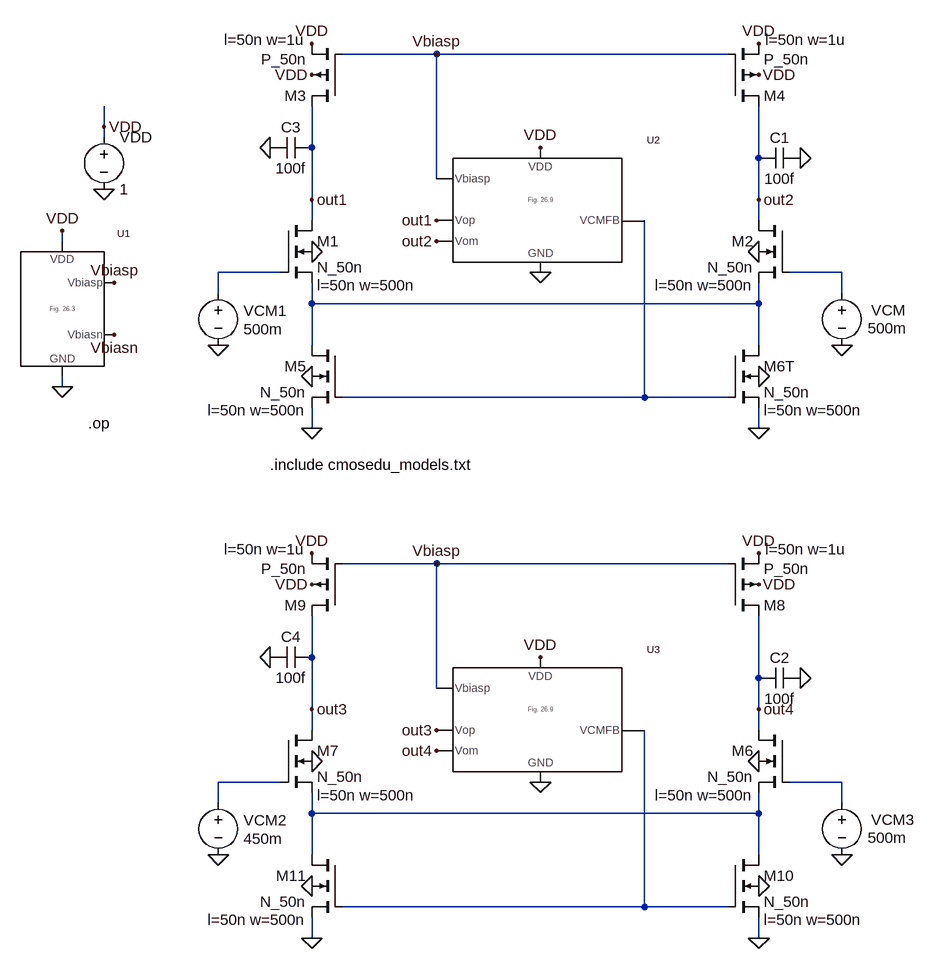
[diagram p0: schematic Fig26_10.asc]
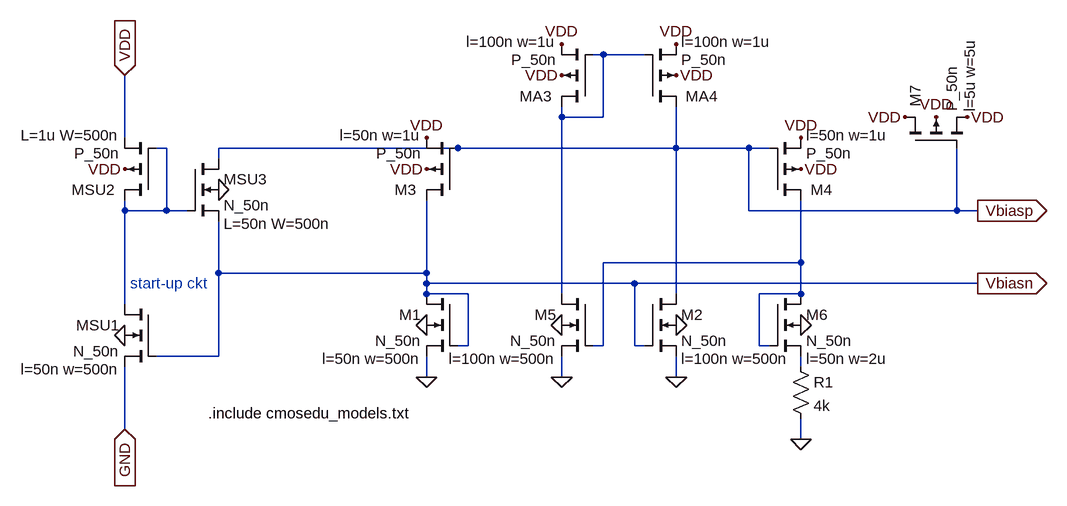
[diagram p1: sub-circuit fig_26_3.asc]
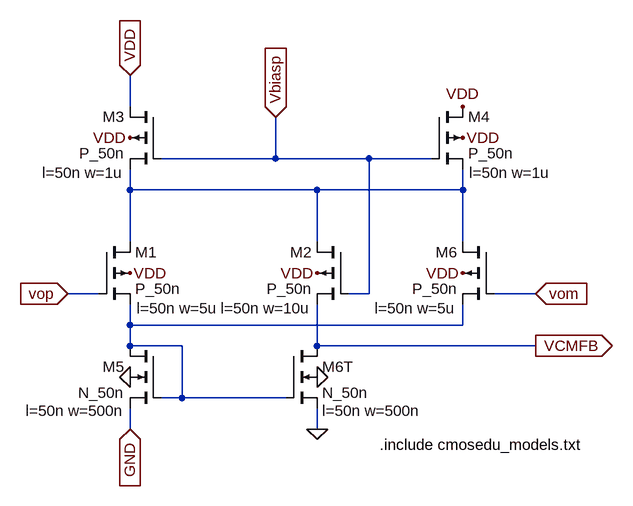
[diagram p2: sub-circuit fig_26_9.asc]
Fig26_10.asc, the LTspice schematic file:
Version 4
SHEET 1 3276 916
WIRE 1376 -464 1232 -464
WIRE 1824 -464 1376 -464
WIRE 864 -352 864 -384
WIRE 864 -336 864 -352
WIRE 1184 -320 1184 -384
WIRE 1872 -304 1872 -384
WIRE 1376 -272 1376 -464
WIRE 1184 -240 1184 -320
WIRE 1872 -240 1872 -304
WIRE 1184 -208 1184 -240
WIRE 1872 -208 1872 -240
WIRE 800 -176 800 -192
WIRE 1136 -128 1040 -128
WIRE 2000 -128 1920 -128
WIRE 1040 -96 1040 -128
WIRE 2000 -96 2000 -128
WIRE 1184 -80 1184 -112
WIRE 1872 -80 1872 -112
WIRE 1872 -80 1184 -80
WIRE 1184 -16 1184 -80
WIRE 1872 -16 1872 -80
WIRE 800 48 800 32
WIRE 1696 64 1696 -208
WIRE 1696 64 1232 64
WIRE 1824 64 1696 64
WIRE 1184 112 1184 80
WIRE 1872 112 1872 80
WIRE 1376 320 1232 320
WIRE 1824 320 1376 320
WIRE 1184 464 1184 400
WIRE 1872 496 1872 400
WIRE 1376 512 1376 320
WIRE 1184 544 1184 464
WIRE 1872 544 1872 496
WIRE 1184 576 1184 544
WIRE 1872 576 1872 544
WIRE 1136 656 1040 656
WIRE 2000 656 1920 656
WIRE 1040 688 1040 656
WIRE 2000 688 2000 656
WIRE 1184 704 1184 672
WIRE 1872 704 1872 672
WIRE 1872 704 1184 704
WIRE 1184 768 1184 704
WIRE 1872 768 1872 704
WIRE 1696 848 1696 576
WIRE 1696 848 1232 848
WIRE 1824 848 1696 848
WIRE 1184 896 1184 864
WIRE 1872 896 1872 864
FLAG 864 -256 0
FLAG 864 -352 VDD
FLAG 1872 -160 0
FLAG 1872 112 0
FLAG 1184 -160 0
FLAG 1872 -480 VDD
FLAG 1872 -432 VDD
FLAG 1184 -432 VDD
FLAG 800 -192 VDD
FLAG 800 48 0
FLAG 1040 -16 0
FLAG 1184 -480 VDD
FLAG 1872 32 0
FLAG 2000 -16 0
FLAG 880 -32 Vbiasn
FLAG 880 -112 Vbiasp
FLAG 1184 112 0
FLAG 1184 32 0
FLAG 1376 -464 Vbiasp
FLAG 1184 -240 out1
FLAG 1872 -240 out2
FLAG 1536 -128 0
FLAG 1376 -208 out1
FLAG 1376 -176 out2
FLAG 1536 -320 VDD
FLAG 1872 624 0
FLAG 1872 896 0
FLAG 1184 624 0
FLAG 1872 304 VDD
FLAG 1872 352 VDD
FLAG 1184 352 VDD
FLAG 1040 768 0
FLAG 1184 304 VDD
FLAG 1872 816 0
FLAG 2000 768 0
FLAG 1184 896 0
FLAG 1184 816 0
FLAG 1376 320 Vbiasp
FLAG 1184 544 out3
FLAG 1872 544 out4
FLAG 1536 656 0
FLAG 1376 576 out3
FLAG 1376 608 out4
FLAG 1536 464 VDD
FLAG 1936 -304 0
FLAG 1936 496 0
FLAG 1120 -320 0
FLAG 1120 464 0
SYMBOL voltage 864 -352 R0
WINDOW 123 0 0 Left 2
WINDOW 39 0 0 Left 2
SYMATTR InstName VDD
SYMATTR Value 1
SYMBOL nmos4 1920 -208 M0
WINDOW 123 56 100 Left 2
SYMATTR Value2 l=50n w=500n
SYMATTR InstName M2
SYMATTR Value N_50n
SYMBOL nmos4 1136 -208 R0
WINDOW 123 56 100 Left 2
SYMATTR Value2 l=50n w=500n
SYMATTR InstName M1
SYMATTR Value N_50n
SYMBOL pmos4 1824 -384 M180
WINDOW 123 58 102 Left 2
WINDOW 0 56 16 Left 2
SYMATTR Value2 l=50n w=1u
SYMATTR InstName M4
SYMATTR Value P_50n
SYMBOL pmos4 1232 -384 R180
WINDOW 123 58 102 Left 2
WINDOW 0 56 16 Left 2
SYMATTR Value2 l=50n w=1u
SYMATTR InstName M3
SYMATTR Value P_50n
SYMBOL voltage 1040 -112 R0
WINDOW 0 39 43 Left 2
WINDOW 123 38 75 Left 2
WINDOW 39 0 0 Left 2
WINDOW 3 39 71 Left 2
SYMATTR InstName VCM1
SYMATTR Value 500m
SYMBOL nmos4 1824 -16 R0
WINDOW 123 56 100 Left 2
SYMATTR Value2 l=50n w=500n
SYMATTR InstName M6T
SYMATTR Value N_50n
SYMBOL voltage 2000 -112 R0
WINDOW 0 45 42 Left 2
WINDOW 3 40 70 Left 2
WINDOW 123 0 0 Left 2
WINDOW 39 0 0 Left 2
SYMATTR InstName VCM
SYMATTR Value 500m
SYMBOL Fig_26_3 736 -64 R0
SYMATTR InstName U1
SYMBOL nmos4 1232 -16 M0
WINDOW 123 56 100 Left 2
SYMATTR Value2 l=50n w=500n
SYMATTR InstName M5
SYMATTR Value N_50n
SYMBOL Fig_26_9 1488 -208 R0
SYMATTR InstName U2
SYMBOL nmos4 1920 576 M0
WINDOW 123 56 100 Left 2
SYMATTR Value2 l=50n w=500n
SYMATTR InstName M6
SYMATTR Value N_50n
SYMBOL nmos4 1136 576 R0
WINDOW 123 56 100 Left 2
SYMATTR Value2 l=50n w=500n
SYMATTR InstName M7
SYMATTR Value N_50n
SYMBOL pmos4 1824 400 M180
WINDOW 123 58 102 Left 2
WINDOW 0 56 16 Left 2
SYMATTR Value2 l=50n w=1u
SYMATTR InstName M8
SYMATTR Value P_50n
SYMBOL pmos4 1232 400 R180
WINDOW 123 58 102 Left 2
WINDOW 0 56 16 Left 2
SYMATTR Value2 l=50n w=1u
SYMATTR InstName M9
SYMATTR Value P_50n
SYMBOL voltage 1040 672 R0
WINDOW 0 39 43 Left 2
WINDOW 123 38 75 Left 2
WINDOW 39 0 0 Left 2
WINDOW 3 39 71 Left 2
SYMATTR InstName VCM2
SYMATTR Value 450m
SYMBOL nmos4 1824 768 R0
WINDOW 123 56 100 Left 2
SYMATTR Value2 l=50n w=500n
SYMATTR InstName M10
SYMATTR Value N_50n
SYMBOL voltage 2000 672 R0
WINDOW 0 45 42 Left 2
WINDOW 3 40 70 Left 2
WINDOW 123 0 0 Left 2
WINDOW 39 0 0 Left 2
SYMATTR InstName VCM3
SYMATTR Value 500m
SYMBOL nmos4 1232 768 M0
WINDOW 123 56 100 Left 2
SYMATTR Value2 l=50n w=500n
SYMATTR InstName M11
SYMATTR Value N_50n
SYMBOL Fig_26_9 1488 576 R0
SYMATTR InstName U3
SYMBOL cap 1872 -320 M90
WINDOW 0 0 32 VBottom 2
WINDOW 3 32 32 VTop 2
SYMATTR InstName C1
SYMATTR Value 100f
SYMBOL cap 1872 480 M90
WINDOW 0 0 32 VBottom 2
WINDOW 3 32 32 VTop 2
SYMATTR InstName C2
SYMATTR Value 100f
SYMBOL cap 1184 -336 R90
WINDOW 0 0 32 VBottom 2
WINDOW 3 32 32 VTop 2
SYMATTR InstName C3
SYMATTR Value 100f
SYMBOL cap 1184 448 R90
WINDOW 0 0 32 VBottom 2
WINDOW 3 32 32 VTop 2
SYMATTR InstName C4
SYMATTR Value 100f
TEXT 1120 168 Left 2 !.include cmosedu_models.txt
TEXT 840 104 Left 2 !.op

fig_26_3.asc, the sub-circuit schematic file:
Version 4
SHEET 1 2004 680
WIRE 1280 -304 1264 -304
WIRE 1344 -304 1280 -304
WIRE 1216 -208 1216 -224
WIRE 1280 -208 1280 -304
WIRE 1280 -208 1216 -208
WIRE 544 -176 544 -272
WIRE 608 -160 592 -160
WIRE 1056 -160 688 -160
WIRE 1392 -160 1392 -224
WIRE 1392 -160 1056 -160
WIRE 1504 -160 1392 -160
WIRE 1536 -160 1504 -160
WIRE 688 -144 688 -160
WIRE 544 -64 544 -80
WIRE 608 -64 608 -160
WIRE 608 -64 544 -64
WIRE 640 -64 608 -64
WIRE 1504 -64 1504 -160
WIRE 1824 -64 1824 -160
WIRE 1824 -64 1504 -64
WIRE 1856 -64 1824 -64
WIRE 1584 16 1584 -80
WIRE 1584 16 1280 16
WIRE 688 32 688 -48
WIRE 1008 32 1008 -80
WIRE 1008 32 688 32
WIRE 1008 48 1008 32
WIRE 1328 48 1008 48
WIRE 1856 48 1328 48
WIRE 1008 64 1008 48
WIRE 1072 64 1008 64
WIRE 1216 64 1216 -208
WIRE 1392 64 1392 -160
WIRE 1584 64 1584 16
WIRE 1584 64 1520 64
WIRE 544 80 544 -64
WIRE 1072 144 1072 64
WIRE 1072 144 1056 144
WIRE 1280 144 1280 16
WIRE 1280 144 1264 144
WIRE 1328 144 1328 48
WIRE 1344 144 1328 144
WIRE 1520 144 1520 64
WIRE 1536 144 1520 144
WIRE 688 160 688 32
WIRE 688 160 592 160
WIRE 1584 176 1584 160
WIRE 1008 192 1008 160
WIRE 1216 192 1216 160
WIRE 1392 192 1392 160
WIRE 544 272 544 176
WIRE 1584 288 1584 256
FLAG 544 -128 VDD
FLAG 1008 -128 VDD
FLAG 1008 -176 VDD
FLAG 1584 -128 VDD
FLAG 1584 -176 VDD
FLAG 1584 288 0
FLAG 1584 112 0
FLAG 1392 -272 VDD
FLAG 1392 -320 VDD
FLAG 1216 -272 VDD
FLAG 1216 -320 VDD
FLAG 1392 112 0
FLAG 1792 -208 VDD
FLAG 1744 -208 VDD
FLAG 1840 -208 VDD
FLAG 544 -272 VDD
IOPIN 544 -272 In
FLAG 544 272 GND
IOPIN 544 272 In
FLAG 688 -96 0
FLAG 544 128 0
FLAG 1008 192 0
FLAG 1008 112 0
FLAG 1216 112 0
FLAG 1216 192 0
FLAG 1392 192 0
FLAG 1856 -64 Vbiasp
IOPIN 1856 -64 Out
FLAG 1856 48 Vbiasn
IOPIN 1856 48 Out
SYMBOL pmos4 592 -80 R180
WINDOW 0 63 16 Left 2
WINDOW 123 56 100 Left 2
SYMATTR InstName MSU2
SYMATTR Value2 L=1u W=500n
SYMATTR Value P_50n
SYMBOL nmos4 592 80 M0
WINDOW 123 56 100 Left 2
SYMATTR Value2 l=50n w=500n
SYMATTR InstName MSU1
SYMATTR Value N_50n
SYMBOL nmos4 640 -144 R0
WINDOW 123 56 100 Left 2
SYMATTR Value2 L=50n W=500n
SYMATTR InstName MSU3
SYMATTR Value N_50n
SYMBOL pmos4 1056 -80 R180
WINDOW 0 63 16 Left 2
WINDOW 123 56 100 Left 2
SYMATTR InstName M3
SYMATTR Value2 l=50n w=1u
SYMATTR Value P_50n
SYMBOL pmos4 1536 -80 M180
WINDOW 0 63 16 Left 2
WINDOW 123 56 100 Left 2
SYMATTR InstName M4
SYMATTR Value2 l=50n w=1u
SYMATTR Value P_50n
SYMBOL nmos4 1056 64 M0
WINDOW 123 56 100 Left 2
SYMATTR Value2 l=50n w=500n
SYMATTR InstName M1
SYMATTR Value N_50n
SYMBOL res 1568 160 R0
SYMATTR InstName R1
SYMATTR Value 4k
SYMBOL pmos4 1344 -224 M180
WINDOW 0 63 16 Left 2
WINDOW 123 56 100 Left 2
SYMATTR InstName MA4
SYMATTR Value2 l=100n w=1u
SYMATTR Value P_50n
SYMBOL pmos4 1264 -224 R180
WINDOW 0 63 16 Left 2
WINDOW 123 56 100 Left 2
SYMATTR InstName MA3
SYMATTR Value2 l=100n w=1u
SYMATTR Value P_50n
SYMBOL nmos4 1264 64 M0
WINDOW 123 56 100 Left 2
SYMATTR Value2 l=100n w=500n
SYMATTR InstName M5
SYMATTR Value N_50n
SYMBOL pmos4 1744 -160 R270
WINDOW 0 63 16 Left 2
WINDOW 123 56 100 Left 2
SYMATTR InstName M7
SYMATTR Value2 l=5u w=5u
SYMATTR Value P_50n
SYMBOL nmos4 1344 64 R0
WINDOW 123 56 100 Left 2
SYMATTR Value2 l=100n w=500n
SYMATTR InstName M2
SYMATTR Value N_50n
SYMBOL nmos4 1536 64 R0
WINDOW 123 56 100 Left 2
SYMATTR Value2 l=50n w=2u
SYMATTR InstName M6
SYMATTR Value N_50n
TEXT 552 48 Left 2 ;start-up ckt
TEXT 672 248 Left 2 !.include cmosedu_models.txt

fig_26_9.asc, the sub-circuit schematic file:
Version 4
SHEET 1 2684 680
WIRE 1184 -384 1184 -432
WIRE 1408 -304 1408 -368
WIRE 1408 -304 1232 -304
WIRE 1552 -304 1408 -304
WIRE 1648 -304 1552 -304
WIRE 1184 -256 1184 -288
WIRE 1472 -256 1184 -256
WIRE 1696 -256 1696 -288
WIRE 1696 -256 1472 -256
WIRE 1184 -176 1184 -256
WIRE 1472 -176 1472 -256
WIRE 1696 -176 1696 -256
WIRE 1136 -96 1088 -96
WIRE 1552 -96 1552 -304
WIRE 1552 -96 1520 -96
WIRE 1808 -96 1744 -96
WIRE 1184 -48 1184 -80
WIRE 1696 -48 1696 -80
WIRE 1696 -48 1184 -48
WIRE 1184 -16 1184 -48
WIRE 1264 -16 1184 -16
WIRE 1472 -16 1472 -80
WIRE 1808 -16 1472 -16
WIRE 1264 64 1264 -16
WIRE 1264 64 1232 64
WIRE 1424 64 1264 64
WIRE 1184 112 1184 80
WIRE 1472 112 1472 80
FLAG 1472 112 0
FLAG 1696 -384 VDD
FLAG 1696 -336 VDD
FLAG 1184 -336 VDD
FLAG 1472 32 0
FLAG 1184 32 0
FLAG 1184 -128 VDD
FLAG 1472 -128 VDD
FLAG 1696 -128 VDD
FLAG 1408 -368 Vbiasp
IOPIN 1408 -368 In
FLAG 1184 -432 VDD
IOPIN 1184 -432 In
FLAG 1088 -96 vop
IOPIN 1088 -96 In
FLAG 1808 -96 vom
IOPIN 1808 -96 In
FLAG 1808 -16 VCMFB
IOPIN 1808 -16 Out
FLAG 1184 112 GND
IOPIN 1184 112 In
SYMBOL pmos4 1648 -384 R0
WINDOW 123 58 102 Left 0
WINDOW 0 56 16 Left 0
SYMATTR Value2 l=50n w=1u
SYMATTR InstName M4
SYMATTR Value P_50n
SYMBOL pmos4 1232 -384 M0
WINDOW 123 58 102 Left 0
WINDOW 0 56 16 Left 0
SYMATTR Value2 l=50n w=1u
SYMATTR InstName M3
SYMATTR Value P_50n
SYMBOL nmos4 1424 -16 R0
WINDOW 123 56 100 Left 0
SYMATTR Value2 l=50n w=500n
SYMATTR InstName M6T
SYMATTR Value N_50n
SYMBOL nmos4 1232 -16 M0
WINDOW 123 56 100 Left 0
SYMATTR Value2 l=50n w=500n
SYMATTR InstName M5
SYMATTR Value N_50n
SYMBOL pmos4 1136 -176 R0
WINDOW 123 58 102 Left 0
WINDOW 0 56 16 Left 0
SYMATTR Value2 l=50n w=5u
SYMATTR InstName M1
SYMATTR Value P_50n
SYMBOL pmos4 1520 -176 M0
WINDOW 123 58 102 Left 0
WINDOW 0 56 16 Left 0
SYMATTR Value2 l=50n w=10u
SYMATTR InstName M2
SYMATTR Value P_50n
SYMBOL pmos4 1744 -176 M0
WINDOW 123 58 102 Left 0
WINDOW 0 56 16 Left 0
SYMATTR Value2 l=50n w=5u
SYMATTR InstName M6
SYMATTR Value P_50n
TEXT 1568 136 Left 0 !.include cmosedu_models.txt

The netlist it stands for:
* Fig26_10.asc
VDD VDD 0 1
M2 out2 N002 N003 0 N_50n l=50n w=500n
M1 out1 N001 N003 0 N_50n l=50n w=500n
M4 out2 Vbiasp VDD VDD P_50n l=50n w=1u
M3 out1 Vbiasp VDD VDD P_50n l=50n w=1u
VCM1 N001 0 500m
M6T N003 N004 0 0 N_50n l=50n w=500n
VCM N002 0 500m
XU1 Vbiasn Vbiasp VDD 0 fig_26_3
M5 N003 N004 0 0 N_50n l=50n w=500n
XU2 out1 out2 Vbiasp N004 VDD 0 fig_26_9
M6 out4 N006 N007 0 N_50n l=50n w=500n
M7 out3 N005 N007 0 N_50n l=50n w=500n
M8 out4 Vbiasp VDD VDD P_50n l=50n w=1u
M9 out3 Vbiasp VDD VDD P_50n l=50n w=1u
VCM2 N005 0 450m
M10 N007 N008 0 0 N_50n l=50n w=500n
VCM3 N006 0 500m
M11 N007 N008 0 0 N_50n l=50n w=500n
XU3 out3 out4 Vbiasp N008 VDD 0 fig_26_9
C1 out2 0 100f
C2 out4 0 100f
C3 out1 0 100f
C4 out3 0 100f

* block symbol definitions
.subckt fig_26_3 Vbiasn Vbiasp VDD GND
MSU2 N002 N002 VDD VDD P_50n L=1u W=500n
MSU1 N002 Vbiasn GND 0 N_50n l=50n w=500n
MSU3 Vbiasp N002 Vbiasn 0 N_50n L=50n W=500n
M3 Vbiasn Vbiasp VDD VDD P_50n l=50n w=1u
M4 N003 Vbiasp VDD VDD P_50n l=50n w=1u
M1 Vbiasn Vbiasn 0 0 N_50n l=50n w=500n
R1 N004 0 4k
MA4 Vbiasp N001 VDD VDD P_50n l=100n w=1u
MA3 N001 N001 VDD VDD P_50n l=100n w=1u
M5 N001 N003 0 0 N_50n l=100n w=500n
M7 VDD Vbiasp VDD VDD P_50n l=5u w=5u
M2 Vbiasp Vbiasn 0 0 N_50n l=100n w=500n
M6 N003 N003 N004 0 N_50n l=50n w=2u
* start-up ckt
.include cmosedu_models.txt
.ends fig_26_3

.subckt fig_26_9 Vop Vom Vbiasp VCMFB VDD GND
M4 VDD Vbiasp N001 VDD P_50n l=50n w=1u
M3 VDD Vbiasp N001 VDD P_50n l=50n w=1u
M6T VCMFB N002 0 0 N_50n l=50n w=500n
M5 N002 N002 GND 0 N_50n l=50n w=500n
M1 N001 vop N002 VDD P_50n l=50n w=5u
M2 N001 Vbiasp VCMFB VDD P_50n l=50n w=10u
M6 N001 vom N002 VDD P_50n l=50n w=5u
.include cmosedu_models.txt
.ends fig_26_9

.model NMOS NMOS
.model PMOS PMOS
.lib standard.mos
.include cmosedu_models.txt
.op
.backanno
.end